# EAGLE design RP2040-AD9833 front panel 12-17-22 (EAGLE 9.6.2)
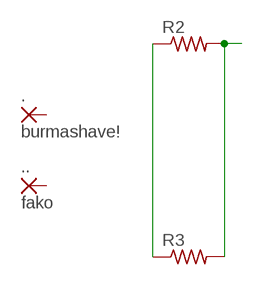
[diagram p0: schematic, sheet 1]

## Parts
.  burmashave!  WIREPAD_WIREPADSMD1,27-254  [WIREPAD_SMD1,27-2,54]
..  fako  WIREPAD_WIREPADSMD1,27-254  [WIREPAD_SMD1,27-2,54]
R2  R-US_MELF0207R  [MINI_MELF-0207R]
R3  R-US_MELF0207R  [MINI_MELF-0207R]

## Nets
N$1: R2.1 R3.1
N$2: R2.2 R3.2
Unconnected: ..1(P) ...1(P)

## Library data of the parts
. .. = avr328 11-4-21:WIREPAD_WIREPAD: Wire PAD connect wire on PCB
R2 R3 = adafruit:R-US_: RESISTOR, American symbol

## Board
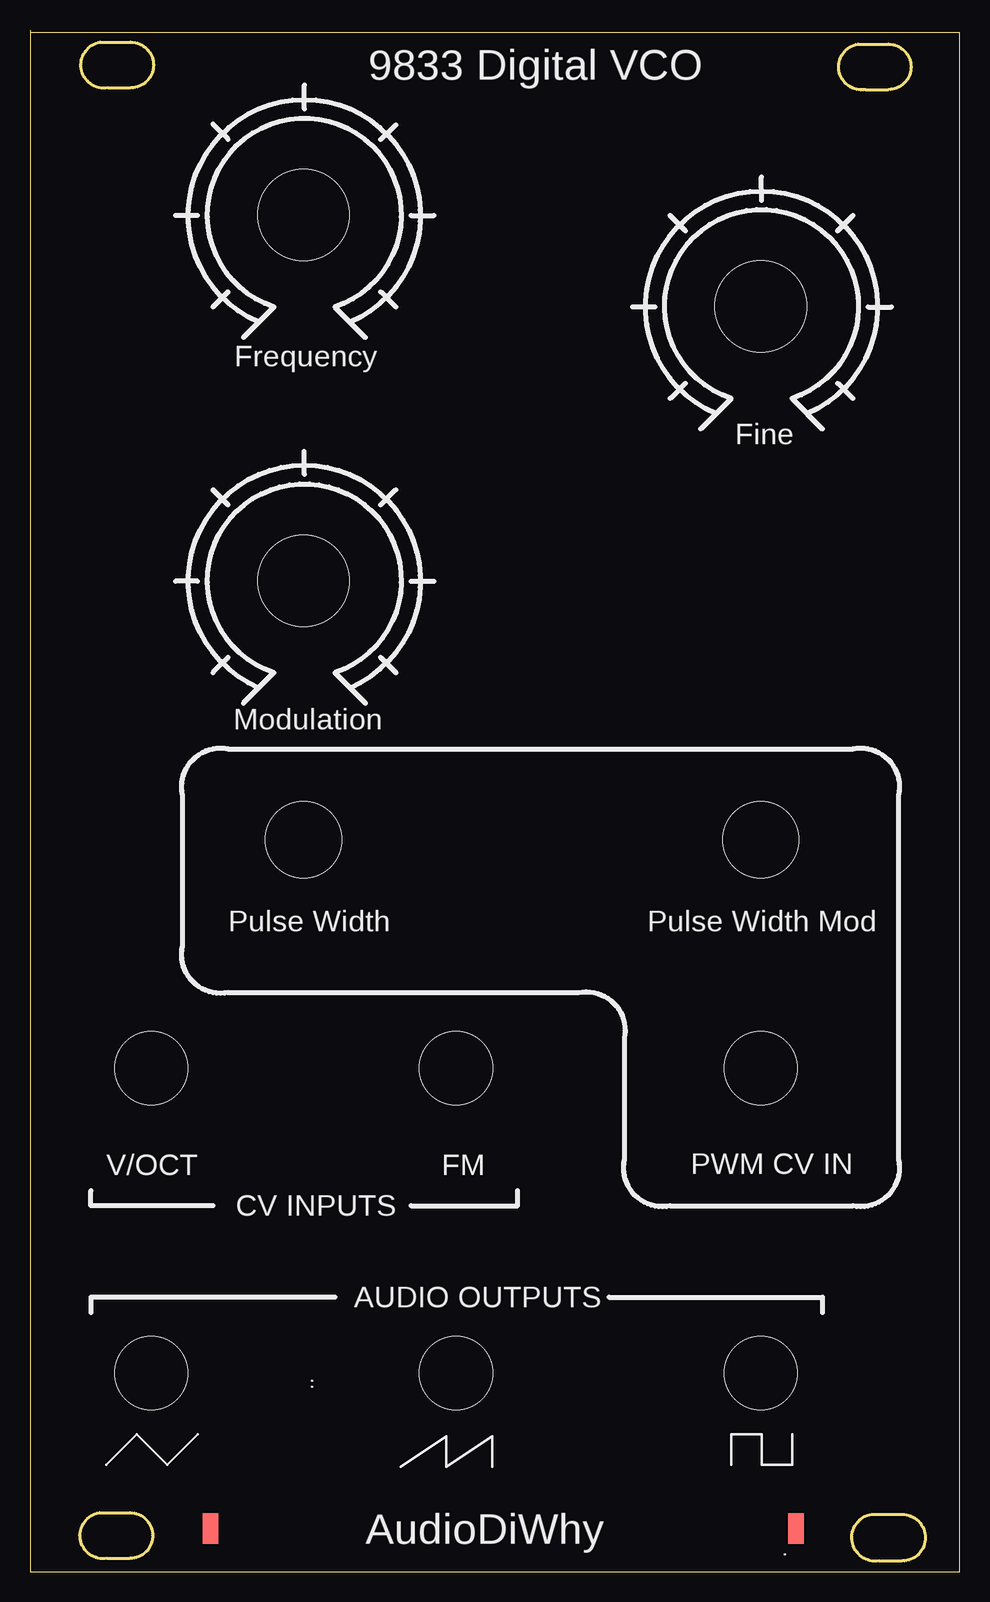
[diagram p1: board, top side]
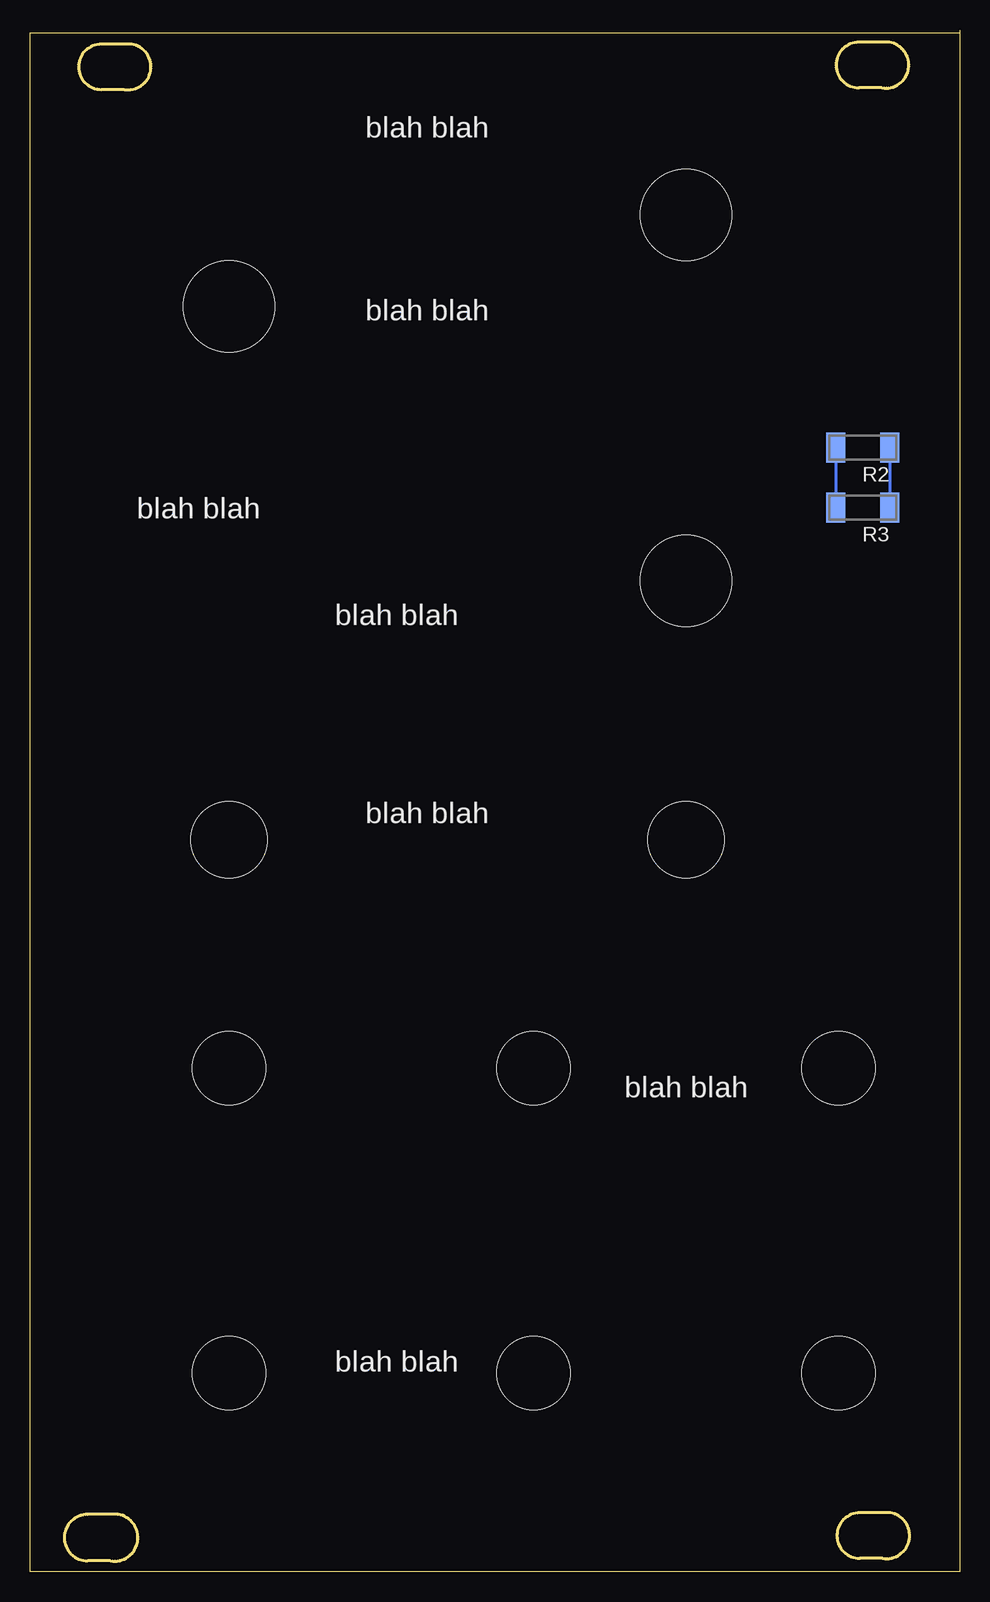
[diagram p2: board, bottom side, seen from below]

Size 77.47 x 128.5 mm. Coordinates in mm from the lower left corner, seen from the top.
Outline: 0,0 40.5,0
Outline: 0,128.5 0,128.27
Outline: 0,128.27 0,0
Outline: 0,0 77.47,0 77.47,128.27 0,128.27
Copper layers (1*16): Top 0.035mm / dielectric 1.5mm / Bottom 0.035mm
Design rules "default": minimum track width 6mil, minimum drill 0.35mm, track to track 6mil, track to pad 6mil, pad to pad 6mil, via to via 6mil, smd to smd 6mil, copper to edge 40mil, drill to drill 6mil, minimum pad ring 10mil, minimum via ring 8mil, stop-mask expansion 4mil, vias tented up to drill 0mil, thermal gap 10mil
Holes 6.1 mm at 10.1,16.55 35.5,16.55 60.9,16.55 10.1,41.95 35.5,41.95 60.9,41.95
Holes 6.35 mm at 22.8,61 60.9,61
Holes 7.62 mm at 22.8,82.59 60.9,105.45 22.8,113.07
Milling: 16 lines

### Footprints (pad centres in the part's own frame; a part is rotated, then mirrored left to right if it is on the bottom)
WIREPAD_SMD1,27-2,54 = smd 1.27 x 2.54: 1 0,0
MINI_MELF-0207R = smd 1.6 x 2.5: 1 -2.25,0; 2 2.25,0

### Placement (x,y rotation side)
.  63.83,3.58 0 top
..  15.04,3.58 0 top
R2  8.07,93.7 180 bottom
R3  8.07,88.7 180 bottom

### Tracks (layer width: path | path; a pad name or v marks a point on that pad's centre or on a via)
N$1
  Bottom 0.254: R2.1 R3.1
N$2
  Bottom 0.254: R2.2 R3.2

### Text on the board
tNames: 9833 Digital VCO | Frequency | Fine | Modulation | Pulse Width | Pulse Width Mod | V/OCT | FM | PWM CV IN | CV INPUTS | AUDIO OUTPUTS | AudioDiWhy
bNames: blah blah | blah blah | blah blah | blah blah | blah blah | blah blah | blah blah